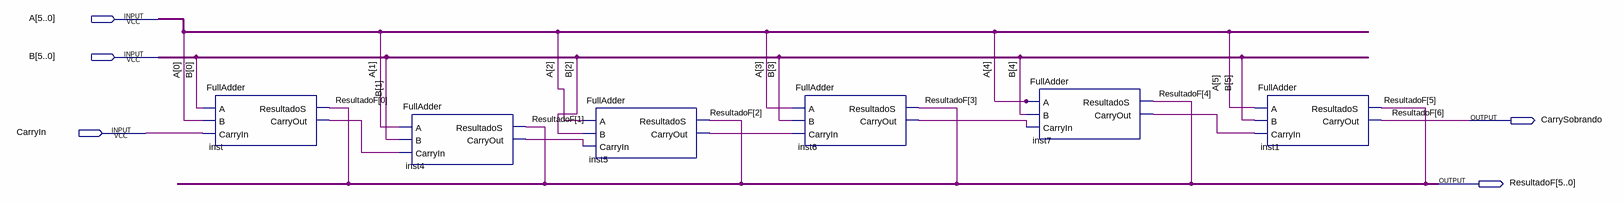
[diagram p0: schematic sheet]
// Quartus schematic Somador6bits.bdf as structural Verilog: 6 symbols, 5 pins
module Somador6bits (
  input  [5:0] A,
  input  [5:0] B,
  input  CarryIn,
  output CarrySobrando,
  output [5:0] ResultadoF
);

  wire inst4_carryout, inst5_carryout, inst6_carryout, inst7_carryout, inst_carryout;

  FullAdder inst (.A(B[0]), .B(A[0]), .CarryIn(CarryIn), .ResultadoS(ResultadoF[0]), .CarryOut(inst_carryout));
  FullAdder inst4 (.A(A[1]), .B(B[1]), .CarryIn(inst_carryout), .ResultadoS(ResultadoF[1]), .CarryOut(inst4_carryout));
  FullAdder inst5 (.A(A[2]), .B(B[2]), .CarryIn(inst4_carryout), .ResultadoS(ResultadoF[2]), .CarryOut(inst5_carryout));
  FullAdder inst6 (.A(A[3]), .B(B[3]), .CarryIn(inst5_carryout), .ResultadoS(ResultadoF[3]), .CarryOut(inst6_carryout));
  FullAdder inst7 (.A(A[4]), .B(B[4]), .CarryIn(inst6_carryout), .ResultadoS(ResultadoF[4]), .CarryOut(inst7_carryout));
  FullAdder inst1 (.A(A[5]), .B(B[5]), .CarryIn(inst7_carryout), .ResultadoS(ResultadoF[5]), .CarryOut(CarrySobrando));

  // Other names for the same wires on the sheet: ResultadoF[6] = CarrySobrando
endmodule
